# Altium schematic sheet ADC Channels.SchDoc
size A; SheetNumber: 6; SheetTotal: 8
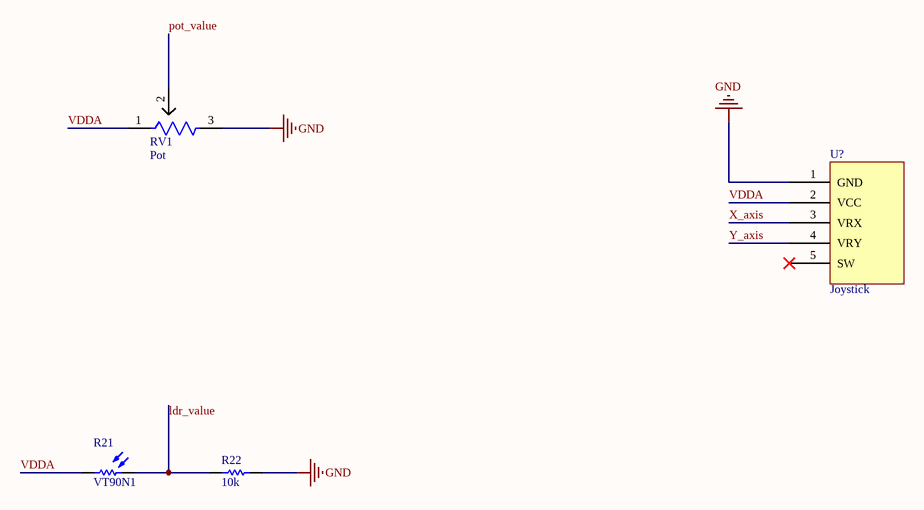
[diagram p0: ADC Channels.SchDoc]

## Parts
R21  VT90N1  [EXCE-VT90N1]
R22  value 10k  [RESC2013X70X40NL20T20]  (hidden comment: ERJ6ENF47R0V)
RV1  Pot  [Potansiyometre]
U?  Joystick  [Joystick]

## Nets
GND: R22.1 RV1.3 U?.1(GND)
ldr_value: R21.2 R22.2
pot_value: RV1.2
VDDA: R21.1 RV1.1 U?.2(VCC)
X_axis: U?.3(VRX)
Y_axis: U?.4(VRY)

Not connected (* = marked no-connect by the designer): U? 5(SW)*

## Library data of the parts
R21 = CMP-2000-07406-1: Photoconductive Resistor, 200 kOhm, 100 V, 80 mW, -40 to 75 degC, 2-Pin THD, RoHS; Manufacturer: Excelitas Technology; SVHC: Cadmiumchloride(15-Jun-2015); Power Rating: 80mW; Resistance @ Lux: 12kohm; Voltage Rating: 100V; Product Range: -; Datasheet Version: 09/2006; Resistor Case Style: -; Operating Temperature Max: 75°C; Package Reference: VT90N1; Datasheet URL: http://datasheet.octopart.com/VT90N1-Excelitas-datasheet-10388451.pdf; Mounting Technology: ThroughHole; Operating Temperature Min: -40°C; Dark Resistance: 200kohm; Package Description: 2-Pin Through Hole Device, Body Width 4.17 mm (Max), Height 2.29 mm; Manufacturer URL: http://www.excelitas.com/Pages/Index.aspx; Packaging: Each
R22 = CMP-2001-00205-1: Manufacturer: Panasonic; Part Number: ERJ6ENF47R0V
RV1 = Potansiyometre: 100K Potantiometer
U? = Joystick: 2 axial Joystick